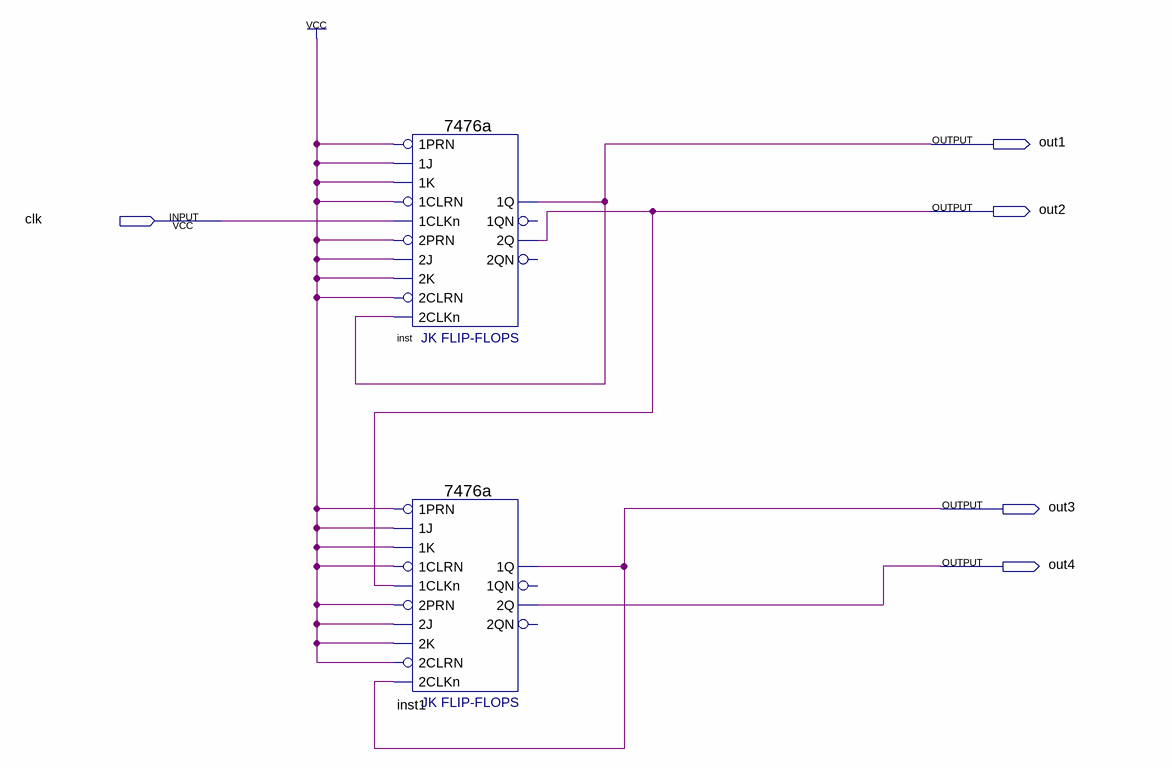
[diagram p0: schematic sheet]
// Quartus schematic Lab1partB.bdf as structural Verilog: 2 symbols, 5 pins
module Lab1partB (
  input  clk,
  output out1,
  output out2,
  output out3,
  output out4
);

  \7476a  inst (
    .\2CLKn (out1), .\2CLRN (1'b1), .\1PRN (1'b1), .\1K (1'b1), .\1J (1'b1), .\1CLRN (1'b1), .\1CLKn (clk),
    .\2K (1'b1), .\2J (1'b1), .\2PRN (1'b1), .\2Q (out2), .\1Q (out1));  // open: 2QN, 1QN
  \7476a  inst1 (
    .\2CLKn (out3), .\2CLRN (1'b1), .\1PRN (1'b1), .\1K (1'b1), .\1J (1'b1), .\1CLRN (1'b1), .\1CLKn (out2),
    .\2K (1'b1), .\2J (1'b1), .\2PRN (1'b1), .\2Q (out4), .\1Q (out3));  // open: 2QN, 1QN
endmodule
